# Altium schematic sheet DigitalandPWR.SchDoc
size A4; SheetNumber: 2; SheetTotal: 3
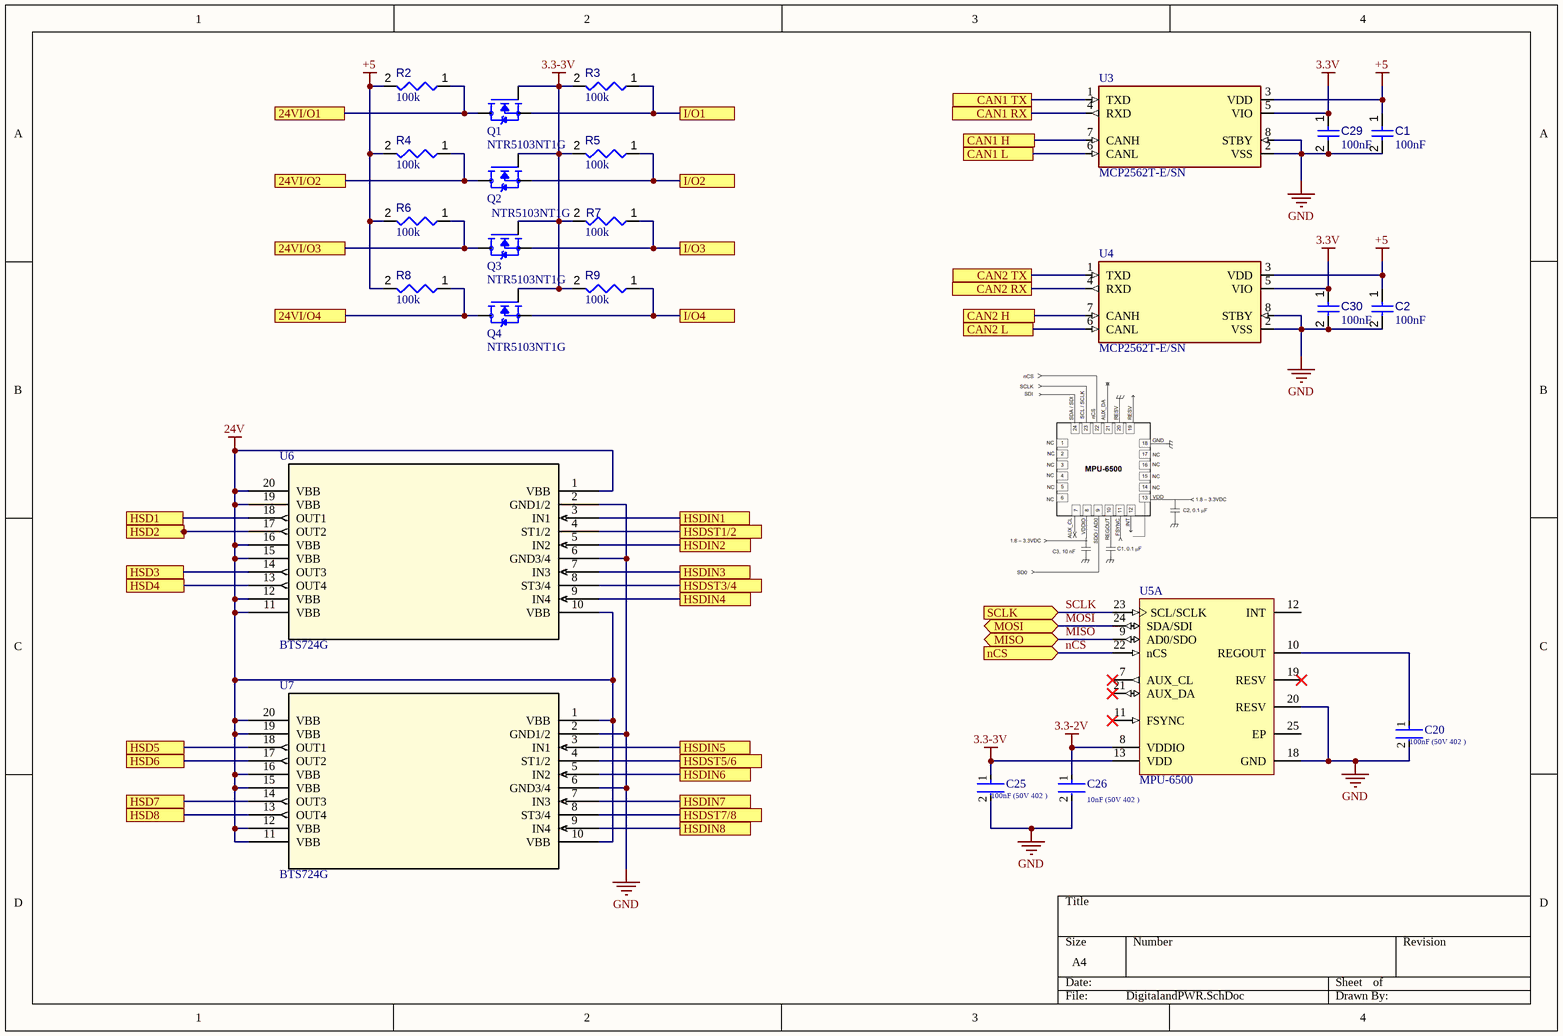
[diagram p0: DigitalandPWR.SchDoc]

## Parts
C1  value 100nF  [CAPC0402(1005)60_L]  (hidden comment: Capacitor 100nF +/-20% 25V 0402)
C2  value 100nF  [CAPC0402(1005)60_L]  (hidden comment: Capacitor 100nF +/-20% 25V 0402)
C20  100nF (50V 402 )  [FP-CL779-IPC_C]
C25  100nF (50V 402 )  [FP-CL779-IPC_C]
C26  10nF (50V 402 )  [FP-CL165-IPC_C]
C29  value 100nF  [CAPC0402(1005)60_L]  (hidden comment: Capacitor 100nF +/-20% 25V 0402)
C30  value 100nF  [CAPC0402(1005)60_L]  (hidden comment: Capacitor 100nF +/-20% 25V 0402)
Q1  NTR5103NT1G  [SOT95P237X111-3N]
Q2  NTR5103NT1G  [SOT95P237X111-3N]
Q3  NTR5103NT1G  [SOT95P237X111-3N]
Q4  NTR5103NT1G  [SOT95P237X111-3N]
R2  value 100k  [RESC0402(1005)_L]  (hidden comment: Resistor 100K +/-1 % 0402 63 mW)
R3  value 100k  [RESC0402(1005)_L]  (hidden comment: Resistor 100K +/-1 % 0402 63 mW)
R4  value 100k  [RESC0402(1005)_L]  (hidden comment: Resistor 100K +/-1 % 0402 63 mW)
R5  value 100k  [RESC0402(1005)_L]  (hidden comment: Resistor 100K +/-1 % 0402 63 mW)
R6  value 100k  [RESC0402(1005)_L]  (hidden comment: Resistor 100K +/-1 % 0402 63 mW)
R7  value 100k  [RESC0402(1005)_L]  (hidden comment: Resistor 100K +/-1 % 0402 63 mW)
R8  value 100k  [RESC0402(1005)_L]  (hidden comment: Resistor 100K +/-1 % 0402 63 mW)
R9  value 100k  [RESC0402(1005)_L]  (hidden comment: Resistor 100K +/-1 % 0402 63 mW)
U3  MCP2562T-E/SN  [SOIC127P600X175-8N]
U4  MCP2562T-E/SN  [SOIC127P600X175-8N]
U5  MPU-6500  [INSE-MPU-6500-QFN24_M]  (part A of 2)
U6  BTS724G  [SOIC-20_INF]
U7  BTS724G  [SOIC-20_INF]

## Ports
24VI/O1, 24VI/O2, 24VI/O3, 24VI/O4, CAN1 H, CAN1 L, CAN1 RX, CAN1 TX, CAN2 H, CAN2 L, CAN2 RX, CAN2 TX, HSD1, HSD2, HSD3, HSD4, HSD5, HSD6, HSD7, HSD8, HSDIN1, HSDIN2, HSDIN3, HSDIN4, HSDIN5, HSDIN6, HSDIN7, HSDIN8, HSDST1/2, HSDST3/4, HSDST5/6, HSDST7/8, I/O1, I/O2, I/O3, I/O4, MISO (bidir), MOSI (bidir), nCS (in), SCLK (in)

## Nets
3.3-2V: C26.1 U5.8(VDDIO)
3.3-3V: C25.1 Q1.1(G) Q2.1(G) Q3.1(G) Q4.1(G) R3.2 R5.2 R7.2 R9.2 U5.13(VDD)
3.3V: C29.1 C30.1 U3.5(VIO) U4.5(VIO)
24V: U6.1(VBB) U6.10(VBB) U6.11(VBB) U6.12(VBB) U6.15(VBB) U6.16(VBB) U6.19(VBB) U6.20(VBB) U7.1(VBB) U7.10(VBB) U7.11(VBB) U7.12(VBB) U7.15(VBB) U7.16(VBB) U7.19(VBB) U7.20(VBB)
+5: C1.1 C2.1 R2.2 R4.2 R6.2 R8.2 U3.3(VDD) U4.3(VDD)
GND: C1.2 C2.2 C20.2 C25.2 C26.2 C29.2 C30.2 U3.2(VSS) U3.8(STBY) U4.2(VSS) U4.8(STBY) U5.18(GND) U5.20(RESV) U6.2(GND1/2) U6.6(GND3/4) U7.2(GND1/2) U7.6(GND3/4)
24VI/O1: Q1.3(D) R2.1 ; port 24VI/O1
24VI/O2: Q2.3(D) R4.1 ; port 24VI/O2
24VI/O3: Q3.3(D) R6.1 ; port 24VI/O3
24VI/O4: Q4.3(D) R8.1 ; port 24VI/O4
CAN1 H: U3.7(CANH) ; port CAN1 H
CAN1 L: U3.6(CANL) ; port CAN1 L
CAN1 RX: U3.4(RXD) ; port CAN1 RX
CAN1 TX: U3.1(TXD) ; port CAN1 TX
CAN2 H: U4.7(CANH) ; port CAN2 H
CAN2 L: U4.6(CANL) ; port CAN2 L
CAN2 RX: U4.4(RXD) ; port CAN2 RX
CAN2 TX: U4.1(TXD) ; port CAN2 TX
HSD1: U6.18(OUT1) ; port HSD1
HSD2: U6.17(OUT2) ; port HSD2
HSD3: U6.14(OUT3) ; port HSD3
HSD4: U6.13(OUT4) ; port HSD4
HSD5: U7.18(OUT1) ; port HSD5
HSD6: U7.17(OUT2) ; port HSD6
HSD7: U7.14(OUT3) ; port HSD7
HSD8: U7.13(OUT4) ; port HSD8
HSDIN1: U6.3(IN1) ; port HSDIN1
HSDIN2: U6.5(IN2) ; port HSDIN2
HSDIN3: U6.7(IN3) ; port HSDIN3
HSDIN4: U6.9(IN4) ; port HSDIN4
HSDIN5: U7.3(IN1) ; port HSDIN5
HSDIN6: U7.5(IN2) ; port HSDIN6
HSDIN7: U7.7(IN3) ; port HSDIN7
HSDIN8: U7.9(IN4) ; port HSDIN8
HSDST1/2: U6.4(ST1/2) ; port HSDST1/2
HSDST3/4: U6.8(ST3/4) ; port HSDST3/4
HSDST5/6: U7.4(ST1/2) ; port HSDST5/6
HSDST7/8: U7.8(ST3/4) ; port HSDST7/8
I/O1: Q1.2(S) R3.1 ; port I/O1
I/O2: Q2.2(S) R5.1 ; port I/O2
I/O3: Q3.2(S) R7.1 ; port I/O3
I/O4: Q4.2(S) R9.1 ; port I/O4
MISO: U5.9(AD0/SDO) ; port MISO
MOSI: U5.24(SDA/SDI) ; port MOSI
nCS: U5.22(nCS) ; port nCS
SCLK: U5.23(SCL/SCLK) ; port SCLK
NetC20_1: C20.1 U5.10(REGOUT)

Not connected (* = marked no-connect by the designer): U5 7(AUX_CL)* 11(FSYNC)* 12(INT) 19(RESV)* 21(AUX_DA)* 25(EP)

## Library data of the parts
C1 C2 C29 C30 = CMP-001-00065-4: Chip Capacitor, 100nF +/-20%, 25V, 0402, Thickness 0.6 mm; Tolerance: 10%; Max Operating Temperature: 85°C; Min Operating Temperature: -55°C; Pins: 2; Voltage Rating: 25V; Mounting Technology: SMT; Case/Package: 0402
C20 C25 = CMP-13271-002336-1: Cap Ceramic 100nF 50V X7R ±10% SMD 0402 +125°C Paper T/R
C26 = CMP-13271-000387-1: Cap Ceramic 10nF 50V X7R ±10% SMD 0402 +125°C Paper T/R; Depth: 0.5mm; Length: 1mm; Lead Free: Lead Free; Case Code (Metric): 1005; Width: 0.02inch; Min Operating Temperature: -55°C; Thickness: 0.022inch; Package Quantity: 1; Mount: Surface Mount; Height: 0.5mm; Voltage: 50V; Material: Ceramic; Tolerance: 10%; Case Code (Imperial): 0402; Radiation Hardening: No; Case/Package: 0402; Max Operating Temperature: 125°C; Voltage Rating (DC): 50V; Contact Plating: Tin; Packaging: Tape and Reel; Voltage Rating: 50V; Capacitance: 10nF; Dielectric: X7R
Q1-Q4 = CMP-017-000000-1: N-Channel 60V 260mA _Ta_ 300mW _Ta_ Surface Mount SOT-23-3 _TO-236_; MF: ON Semiconductor; Availability: Unavailable; MP: NTR5103NT1G; Source: SnapEDAsch.SchLib; Price: None; Component Type: Standard; Design Item ID: NTR5103NT1G; SnapEDA_Link: https://www.snapeda.com/parts/NTR5103NT1G/ON%20Semiconductor/view-part/565803/?ref=snap; Value: *; Pin Count: 3; Package: SOT-23 ON Semiconductor
R2-R9 = CMP-009-00168-3: Chip Resistor, 100 kOhms, +/-1 %, 63 mW, -55 to 155 degC, 0402; Tolerance: 1%; Power: 63mW; Max Operating Temperature: 155°C; Min Operating Temperature: -55°C; Pins: 2; Case/Package: 0402
U3 U4 = CMP-229-000000-1: 1/1 Transceiver Half CANbus 8-SOIC; MF: Microchip; Digi-Key_Part_Number: MCP2562T-E/SNCT-ND; Pin Count: 8; Source: SnapEDAsch.SchLib; Package: SO-8 Microchip; Value: *; Component Type: Standard; SnapEDA_Link: https://www.snapeda.com/parts/MCP2562T-E/SN/Microchip/view-part/554377/?ref=snap; Design Item ID: MCP2562T-E/SN; Digi-Key_Purchase_URL: https://www.digikey.com/product-detail/en/microchip-technology/MCP2562T-E-SN/MCP2562T-E-SNCT-ND/5011025?utm_source=snapeda&utm_medium=aggregator&utm_campaign=symbol; MP: MCP2562T-E/SN
U5 = CMP-2000-05154-1: 3-Axis Gyroscope and 3-Axis Accelerometer Motion Processing Unit with I2C and SPI, 1.71 to 3.45 V, -40 to 85 degC, 24-Pin QFN, RoHS, Tape and Reel; Manufacturer: InvenSense; Online Catalog: MPU-6500Series; Output Type: Digital; Sensor Type: GyroscopeandAccelerometer; Featured Product: InvenSense-MPU-6500Six-Axis(Gyro+Acceleromete)MEMSMotionTrackingDevices; Other Names: 1428-1011-6; Article Library: MCUsasSensorHubs; Series: -; Category: Sensors,Transducers; Dynamic Catalog: MPU-6500Series; Standard Package: 1; Manufacturer URL: http://www.invensense.com/; Family: Multifunction; Datasheet Version: Rev. 1.0, 09/2013; Datasheet URL: https://datasheet.ciiva.com/29175/mpu-6500-spec-29175093.pdf
U6 U7 = CMP-201-000000-1: No Description Available; Mfr_Name: Infineon; Design Item ID: BTS724G; Source: BTS724G.SchLib; Type: DEV; RefDes: RefDes; Manufacturer_Part_Number: BTS724G; Copyright: Copyright (C) 2023 Ultra Librarian. All rights reserved.